# Altium schematic sheet 7805.SchDoc
size A4
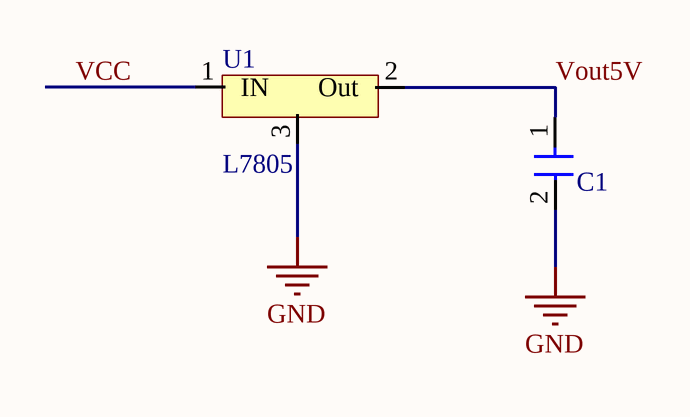
[diagram p0: 7805.SchDoc]

## Parts
C1  Cap  [Cap1]  (value not drawn)
U1  L7805  [TO220]

## Nets
GND: C1.2 U1.3
VCC: U1.1(IN)
Vout5V: C1.1 U1.2(Out)

## Library data of the parts
C1 = R82DC3100DQ50J: CAP FILM 0.1UF 63VDC RADIAL; Manufacturer: Kemet; Capacitance: 0.1µF; Tolerance: ±5%; Voltage Rating - AC: 40V; Voltage Rating - DC: 63V; Dielectric Material: Polyester, Metallized - Stacked; Supplier 1: Digi-Key; Manufacturer Part Number: R82DC3100DQ50J; RoHS: RoHS Compliant; Category: Capacitors; Stock 1: 250000; Pricing 1: 3500=0.0582, 7000=0.05384, 10500=0.05092, 17500=0.04831, 24500=0.04656, 87500=0.04365, 175000=0.03856 (USD); Packaging: Tape & Box (TB); ESR (Equivalent Series Resistance): -; Operating Temperature: -55°C ~ 105°C; Mounting Type: Through Hole; Package / Case: Radial; Size / Dimension: 0.283" L x 0.098" W (7.20mm x 2.50mm); Height - Seated (Max): 0.260" (6.60mm); Termination: PC Pins; Lead Spacing: 0.197" (5.00mm); Applications: General Purpose; Features: -; ComponentLink1URL: http://www.kemet.com/docfinder?Partnumber=R82; ComponentLink1Description: http://www.kemet.com/docfinder?Partnumber=R82
U1 = L7805ACV: Linear Voltage Regulators 5.0V 1.0A Positive; pin to pad: 2>3 3>2; Manufacturer: STMicroelectronics; Input Voltage MAX: 35 V; Number of Outputs: 1; Output Current: 1.5 A; Output Type: Fixed; Output Voltage: 5 V; PSRR / Ripple Rejection - Typ: 68 dB; Input Voltage MIN: 7 V; Line Regulation: 50 mV; Load Regulation: 100 mV; Supplier 1: Mouser; Manufacturer Part Number: L7805ACV; RoHS: RoHS Compliant; Category: Linear Voltage Regulators; Stock 1: 7592; Pricing 1: 1=0.932, 10=0.626, 100=0.416, 1000=0.321, 2500=0.270, 10000=0.261, 25000=0.247, 50000=0.242 (AUD); Package / Case: TO-220; Packaging: Tube; Series: L7805; Brand: STMicroelectronics; Mounting Style: Through Hole; Maximum Operating Temperature: + 125 C; Minimum Operating Temperature: 0 C; Polarity: Positive; Product Category: Voltage Regulators; Standard Pack Qty: 1000; RoHS - Mouser: Y; Minimum Order Quantity: 1; Reeling: False; ComponentLink1URL: http://www.st.com/web/en/resource/technical/document/datasheet/CD00000444.pdf; ComponentLink1Description: http://www.st.com/web/en/resource/technical/document/datasheet/CD00000444.pdf